# Altium schematic sheet Fourier.SchDoc
size A4
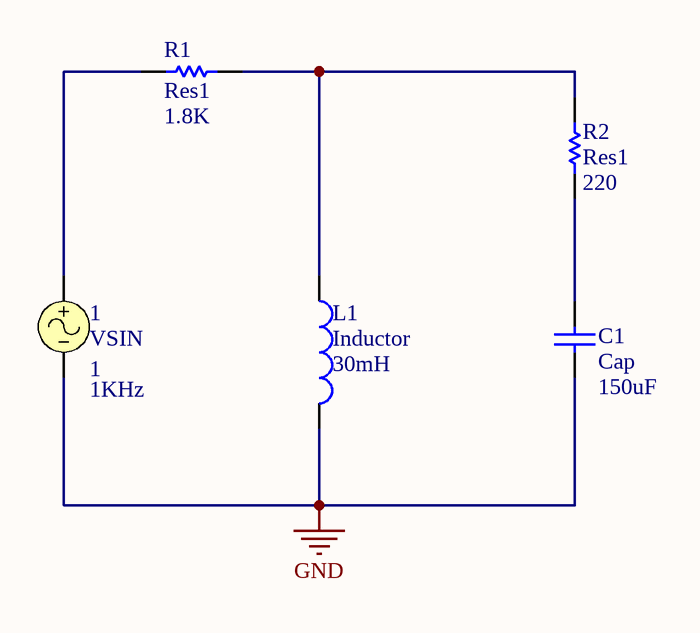
[diagram p0: Fourier.SchDoc]

## Parts
1  VSIN  Amplitude: 1  Frequency: 1KHz
C1  Cap  value 150uF  [RAD-0.3]
L1  Inductor  value 30mH  [0402-A]
R1  Res1  value 1.8K  [AXIAL-0.3]
R2  Res1  value 220  [AXIAL-0.3]

## Nets
GND: 1.2 C1.1 L1.2
Net1_1: 1.1 R1.1
NetC1_2: C1.2 R2.2
NetL1_1: L1.1 R1.2 R2.1

## Library data of the parts
1 = VSIN: Sinusoidal Voltage Source; Note: PCB Footprint - Not required; Published: 8-Jun-2000; LatestRevisionDate: 15-Nov-2004; LatestRevisionNote: Corrected Netlist.; PackageReference: Not Applicable; Publisher: Altium Limited
C1 = Cap: Capacitor; Published: 8-Jun-2000; LatestRevisionDate: 17-Jul-2002; LatestRevisionNote: Re-released for DXP Platform.; PackageReference: RAD-0.3; Publisher: Altium Limited; PackageDescription: Radial Cap, Thru-Hole; 2 Leads; 0.3 in Pin Spacing
L1 = Inductor: Code_IEC: 1005; Published: 8-Jun-2000; LatestRevisionDate: 29-May-2009; LatestRevisionNote: IPC-7351 Footprint Added.; PackageReference: 0402-A; Publisher: Altium Limited; PackageDescription: Chip Inductor; Code_JEITA: 0402
R1 R2 = Res1: Resistor; Published: 8-Jun-2000; LatestRevisionDate: 17-Jul-2002; LatestRevisionNote: Re-released for DXP Platform.; PackageReference: AXIAL-0.3; Publisher: Altium Limited; PackageDescription: Axial Device, Thru-Hole; 2 Leads; 0.3 in Pin Spacing